# Altium schematic sheet Signal_processing_V2.SchDoc
size A4
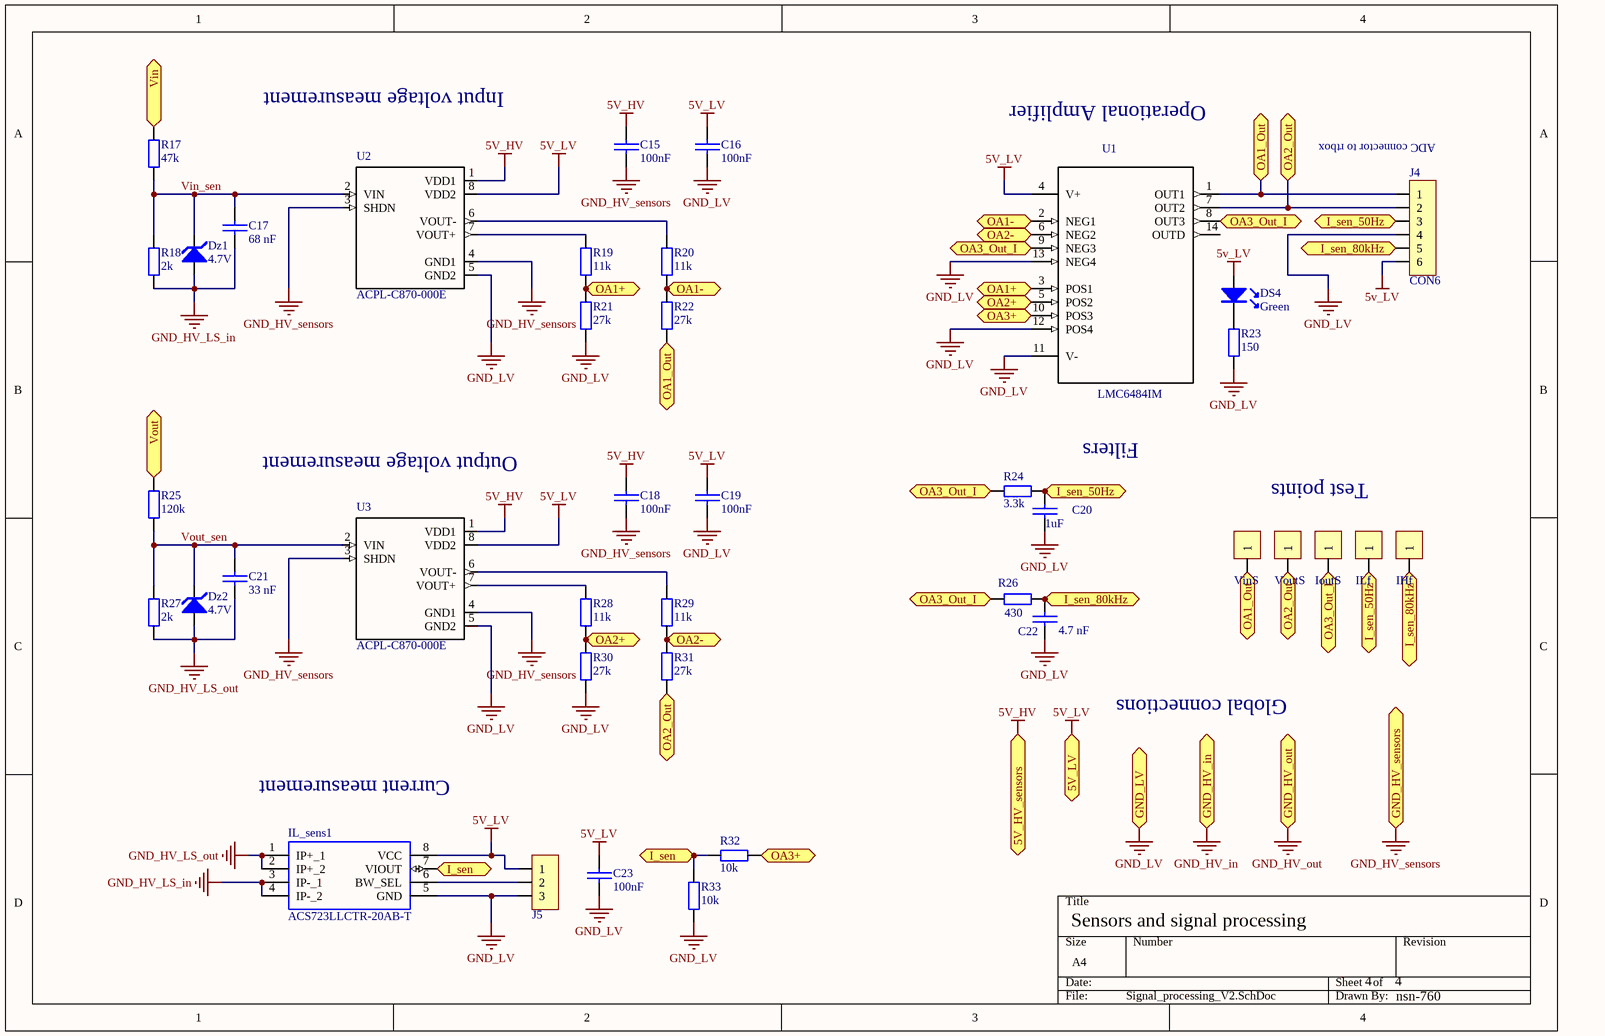
[diagram p0: Signal_processing_V2.SchDoc]

## Parts
C15  100nF  [1206]
C16  100nF  [1206]
C17  68 nF  [Condensador_MKP_200milis - duplicate]
C18  100nF  [1206]
C19  100nF  [1206]
C20  1uF  [Condensador_MKP_200milis - duplicate]
C21  33 nF  [Condensador_MKP_200milis - duplicate]
C22  4.7 nF  [Condensador_MKP_200milis - duplicate]
C23  100nF  [1206]
DS4  Green  [Led 2.2mm]
Dz1  4.7V  [SOT23 - zenner]
Dz2  4.7V  [SOT23 - zenner]
IHf  Test Point  [Test_Point]  (value not drawn)
IL_sens1  ACS723LLCTR-20AB-T  [SOIC8_GND]
ILf  Test Point  [Test_Point]  (value not drawn)
IoutS  Test Point  [Test_Point]  (value not drawn)
J4  CON6  [CON6_KK_256]
J5  Cleva 2 vias  [con_3_100milis]  (value not drawn)
R17  47k  [1206]
R18  2k  [1206]
R19  11k  [1206]
R20  11k  [1206]
R21  27k  [1206]
R22  27k  [1206]
R23  150  [1206]
R24  3.3k  [1206]
R25  120k  [1206]
R26  430  [1206]
R27  2k  [1206]
R28  11k  [1206]
R29  11k  [1206]
R30  27k  [1206]
R31  27k  [1206]
R32  10k  [1206]
R33  10k  [1206]
U1  LMC6484IM  [SOIC_14]
U2  ACPL-C870-000E  [SSOP8]
U3  ACPL-C870-000E  [SSOP8]
VinS  Test Point  [Test_Point]  (value not drawn)
VoutS  Test Point  [Test_Point]  (value not drawn)

## Ports
5V_HV_sensors, 5V_LV, GND_HV_in, GND_HV_out, GND_HV_sensors, GND_LV, I_sen, I_sen_50Hz, I_sen_80kHz, OA1+, OA1-, OA1_Out, OA2+, OA2-, OA2_Out, OA3+, OA3_Out_I, Vin, Vout

## Nets
5V_HV: C15.2 C18.2 U2.1(VDD1) U3.1(VDD1) ; port 5V_HV_sensors
5V_LV: C16.2 C19.2 C23.2 DS4.A IL_sens1.8(VCC) J4.6 J5.1 U1.4(V+) U2.8(VDD2) U3.8(VDD2) ; port 5V_LV
GND_HV_in: port GND_HV_in
GND_HV_LS_in: C17.2 Dz1.1(A) IL_sens1.3(IP-_1) IL_sens1.4(IP-_2) R18.2
GND_HV_LS_out: C21.2 Dz2.1(A) IL_sens1.1(IP+_1) IL_sens1.2(IP+_2) R27.2
GND_HV_out: port GND_HV_out
GND_HV_sensors: C15.1 C18.1 U2.3(SHDN) U2.4(GND1) U3.3(SHDN) U3.4(GND1) ; port GND_HV_sensors
GND_LV: C16.1 C19.1 C20.2 C22.2 C23.1 IL_sens1.5(GND) J4.4 J5.3 R21.2 R23.2 R30.2 R33.2 U1.11(V-) U1.12(POS4) U1.13(NEG4) U2.5(GND2) U3.5(GND2) ; port GND_LV
I_sen: IL_sens1.7(VIOUT) R32.2 R33.1 ; port I_sen
I_sen_50Hz: C20.1 ILf.1 J4.3 R24.1 ; port I_sen_50Hz
I_sen_80kHz: C22.1 IHf.1 J4.5 R26.1 ; port I_sen_80kHz
OA1+: R19.2 R21.1 U1.3(POS1) ; port OA1+
OA1-: R20.2 R22.1 U1.2(NEG1) ; port OA1-
OA1_Out: J4.1 R22.2 U1.1(OUT1) VinS.1 ; port OA1_Out
OA2+: R28.2 R30.1 U1.5(POS2) ; port OA2+
OA2-: R29.2 R31.1 U1.6(NEG2) ; port OA2-
OA2_Out: J4.2 R31.2 U1.7(OUT2) VoutS.1 ; port OA2_Out
OA3+: R32.1 U1.10(POS3) ; port OA3+
OA3_Out_I: IoutS.1 R24.2 R26.2 U1.8(OUT3) U1.9(NEG3) ; port OA3_Out_I
Vin: R17.1 ; port Vin
Vin_sen: C17.1 Dz1.2(K) R17.2 R18.1 U2.2(VIN)
Vout: R25.1 ; port Vout
Vout_sen: C21.1 Dz2.2(K) R25.2 R27.1 U3.2(VIN)
NetDS4_K: DS4.K R23.1
NetIL_sens1_6: IL_sens1.6(BW_SEL) J5.2
NetR19_1: R19.1 U2.7(VOUT+)
NetR20_1: R20.1 U2.6(VOUT-)
NetR28_1: R28.1 U3.7(VOUT+)
NetR29_1: R29.1 U3.6(VOUT-)

Not connected (* = marked no-connect by the designer): U1 14(OUTD)

## Notes on the sheet
- Input voltage measurement
- Operational Amplifier
- (near J4) ADC connector to rtbox
- Output voltage measurement
- Filters
- Test points
- Global connections
- Current measurement
- Sensors and signal processing
- 4
- nsn-760

## Library data of the parts
C15-C23 = Condensador
DS4 = Led
Dz1 Dz2 = Zener: pin to pad: 1>A 2>K
IL_sens1 = ACS723LLCTR-20AB-T: Current Sensor AC/DC 5V 8-Pin SOIC N Allegro Microsystems ACS723LLCTR-20AB-T, Current Sensor, 8-Pin, SOIC; Geometry.Height: 1.75mm; RS Part Number: 1775552; Manufacturer_Name: Allegro Microsystems; Manufacturer_Part_Number: ACS723LLCTR-20AB-T; Datasheet Link: http://uk.rs-online.com/web/p/products/1775552
J4 = CON6: CONECTOR 6 PINES
J5 = Con_3
R17-R33 = Resistencia: Potencia: 1/4W
U1 = LMC6484IM_1: 14 pin CMOS Quad Rail to Rail Input and Output Operational Amplifier 55 per tube; MF: Texas Instruments; Price: None; MP: LMC6484IM; SnapEDA_Link: https://www.snapeda.com/parts/LMC6484IM/Texas%20Instruments/view-part/?ref=snap; Availability: Unavailable; Package: SOIC-14 Texas Instruments; Value: *
U2 U3 = ACPL-C870-000E: Isolation Amplifier [Broadcom] ACPL-C870-000E Isolation Amplifier; MF: Broadcom Limited; Package: SO-8 Broadcom; Digi-Key_Part_Number: 516-2578-5-ND; MP: ACPL-C870-000E; Digi-Key_Purchase_URL: https://www.digikey.dk/product-detail/en/broadcom-limited/ACPL-C870-000E/516-2578-5-ND/3523705?utm_source=snapeda&utm_medium=aggregator&utm_campaign=symbol; SnapEDA_Link: https://www.snapeda.com/parts/ACPL-C870-000E/Broadcom%20Limited/view-part/?ref=snap; Value: *